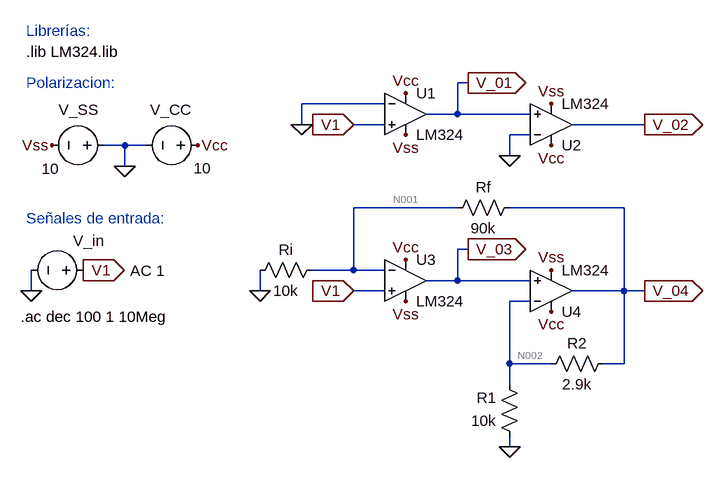
[diagram p0: schematic Lab_3_Circ_1-4.asc]
Lab_3_Circ_1-4.asc, the LTspice schematic file:
Version 4
SHEET 1 1652 680
WIRE 560 -352 544 -352
WIRE 432 -320 304 -320
WIRE 544 -304 544 -352
WIRE 544 -304 496 -304
WIRE 656 -304 544 -304
WIRE 304 -288 304 -320
WIRE 432 -288 384 -288
WIRE 832 -288 720 -288
WIRE 656 -272 624 -272
WIRE 32 -256 0 -256
WIRE 64 -256 32 -256
WIRE 624 -240 624 -272
WIRE 32 -224 32 -256
WIRE 544 -160 384 -160
WIRE 800 -160 624 -160
WIRE 560 -96 544 -96
WIRE 384 -64 384 -160
WIRE 384 -64 320 -64
WIRE 432 -64 384 -64
WIRE 544 -48 544 -96
WIRE 544 -48 496 -48
WIRE 656 -48 544 -48
WIRE -112 -32 -112 -64
WIRE 240 -32 240 -64
WIRE 432 -32 384 -32
WIRE 800 -32 800 -160
WIRE 800 -32 720 -32
WIRE 832 -32 800 -32
WIRE 656 -16 624 -16
WIRE 624 80 624 -16
WIRE 688 80 624 80
WIRE 800 80 800 -32
WIRE 800 80 768 80
WIRE 624 112 624 80
WIRE 624 208 624 192
FLAG 144 -256 Vcc
FLAG 464 -336 Vcc
FLAG -80 -256 Vss
FLAG 464 -272 Vss
FLAG 32 -224 0
FLAG -112 -32 0
FLAG 384 -288 V1
IOPIN 384 -288 In
FLAG -32 -64 V1
IOPIN -32 -64 Out
FLAG 832 -288 V_02
IOPIN 832 -288 Out
FLAG 688 -256 Vcc
FLAG 688 -320 Vss
FLAG 304 -288 0
FLAG 560 -352 V_01
IOPIN 560 -352 Out
FLAG 624 -240 0
FLAG 464 -80 Vcc
FLAG 464 -16 Vss
FLAG 384 -32 V1
IOPIN 384 -32 In
FLAG 832 -32 V_04
IOPIN 832 -32 Out
FLAG 688 0 Vcc
FLAG 688 -64 Vss
FLAG 240 -32 0
FLAG 560 -96 V_03
IOPIN 560 -96 Out
FLAG 624 208 0
SYMBOL OpAmps\\opamp2 464 -368 R0
SYMATTR InstName U1
SYMATTR Value LM324
SYMBOL voltage -16 -64 M270
WINDOW 0 45 31 VLeft 2
WINDOW 3 1 -53 VLeft 2
WINDOW 123 -1 -56 VLeft 2
WINDOW 39 0 0 Left 0
SYMATTR InstName V_in
SYMATTR Value ""
SYMATTR Value2 AC 1
SYMBOL voltage 160 -256 R90
WINDOW 0 -55 25 VRight 2
WINDOW 3 35 -5 VRight 2
WINDOW 123 0 0 Left 0
WINDOW 39 0 0 Left 0
SYMATTR InstName V_CC
SYMATTR Value 10
SYMBOL voltage 16 -256 R90
WINDOW 0 -55 25 VRight 2
WINDOW 3 36 85 VRight 2
WINDOW 123 0 0 Left 0
WINDOW 39 0 0 Left 0
SYMATTR InstName V_SS
SYMATTR Value 10
SYMBOL OpAmps\\opamp2 688 -224 M180
SYMATTR InstName U2
SYMATTR Value LM324
SYMBOL OpAmps\\opamp2 464 -112 R0
SYMATTR InstName U3
SYMATTR Value LM324
SYMBOL OpAmps\\opamp2 688 32 M180
SYMATTR InstName U4
SYMATTR Value LM324
SYMBOL res 640 -176 R90
WINDOW 0 0 56 VBottom 2
WINDOW 3 32 56 VTop 2
SYMATTR InstName Rf
SYMATTR Value 90k
SYMBOL res 336 -80 R90
WINDOW 0 0 56 VBottom 2
WINDOW 3 32 56 VTop 2
SYMATTR InstName Ri
SYMATTR Value 10k
SYMBOL res 784 64 R90
WINDOW 0 0 56 VBottom 2
WINDOW 3 32 56 VTop 2
SYMATTR InstName R2
SYMATTR Value 2.9k
SYMBOL res 640 208 R180
WINDOW 0 36 76 Left 2
WINDOW 3 36 40 Left 2
SYMATTR InstName R1
SYMATTR Value 10k
TEXT -120 -400 Left 2 !.lib LM324.lib
TEXT -120 -432 Left 2 ;Librerías:
TEXT -120 -352 Left 2 ;Polarizacion:
TEXT -120 -144 Left 2 ;Señales de entrada:
TEXT -128 8 Left 2 !.ac dec 100 1 10Meg

The netlist it stands for:
* Lab_3_Circ_1-4.asc
XU1 V1 0 Vcc Vss V_01 LM324  ; pins In+ In- V+ V- OUT
V_in V1 0 AC 1
V_CC Vcc 0 10
V_SS 0 Vss 10
XU2 V_01 0 Vcc Vss V_02 LM324  ; pins In+ In- V+ V- OUT
XU3 V1 N001 Vcc Vss V_03 LM324  ; pins In+ In- V+ V- OUT
XU4 V_03 N002 Vcc Vss V_04 LM324  ; pins In+ In- V+ V- OUT
Rf V_04 N001 90k
Ri N001 0 10k
R2 V_04 N002 2.9k
R1 0 N002 10k
.lib LM324.lib
* Librerías:
* Polarizacion:
* Señales de entrada:
.ac dec 100 1 10Meg
.backanno
.end

* Results of the author's LTspice run, read from the files saved beside the schematic
* Operating Point, zero values left out:
*   V(v_01) = -3.352 V
*   V(vss) = -10 V
*   V(vcc) = 10 V
*   V(v_02) = -9.996 V
*   V(v_03) = -1.574 mV
*   V(n001) = -33.64 µV
*   V(v_04) = -2.131 mV
*   V(n002) = -1.607 mV
*   I(R1) = 160.7 nA
*   I(R2) = -180.6 nA
*   I(Ri) = -3.364 nA
*   I(Rf) = -23.3 nA
*   I(V_ss) = -2.671 mA
*   I(V_cc) = -2.68 mA
*   I(V_in) = 39.85 nA
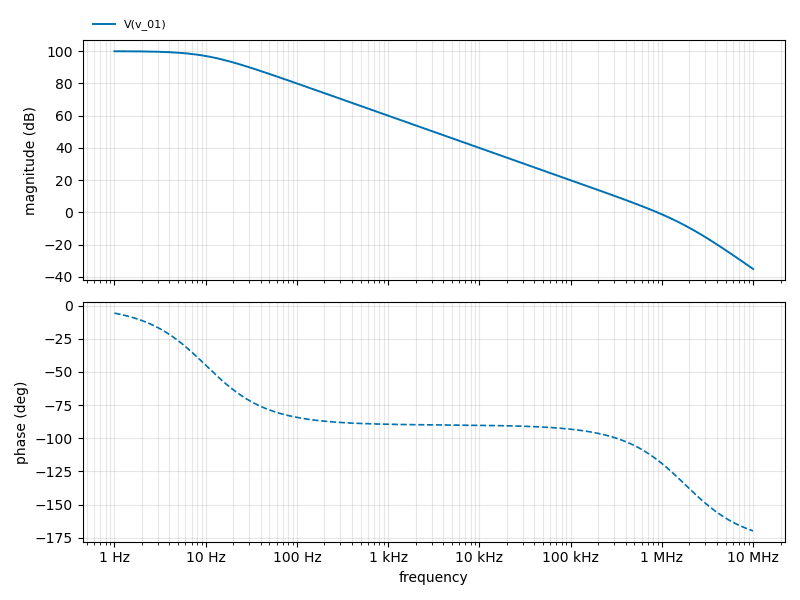
[diagram p1: AC Analysis of Lab_3_Circ_1-4.asc, plotted from the saved traces]
* AC Analysis, 1 run:
*   V(v_01): 99.92 dB at 1 Hz, -35.03 dB at 10 MHz, peak 99.92 dB at 1 Hz, 3 dB below the peak at 10.12 Hz